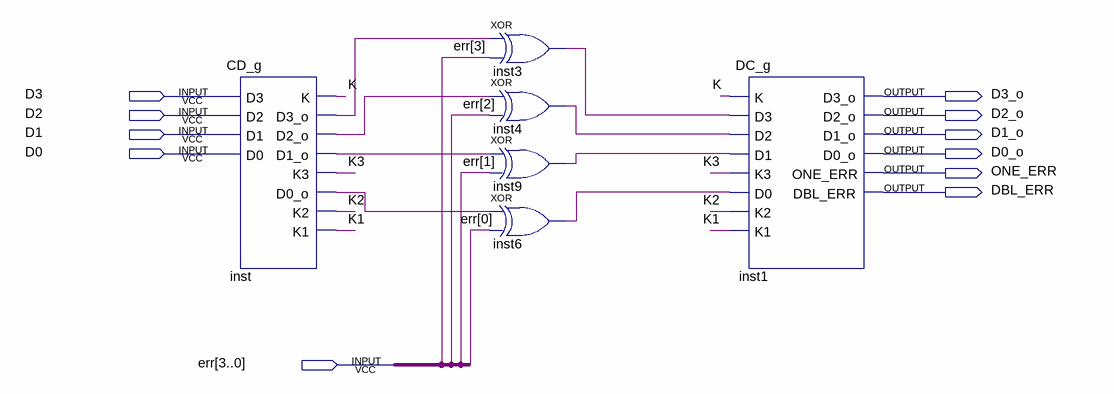
[diagram p0: schematic sheet]
// Quartus schematic data_transf.bdf as structural Verilog: 6 symbols, 11 pins
module data_transf (
  input  D3,
  input  D2,
  input  D1,
  input  D0,
  input  [3:0] err,
  output D3_o,
  output D2_o,
  output D1_o,
  output D0_o,
  output ONE_ERR,
  output DBL_ERR
);

  wire inst3_out, inst4_out, inst6_out, inst9_out, inst_d0_o, inst_d1_o, inst_d2_o, inst_d3_o, K, K1, K2, K3;

  CD_g inst (
    .D3(D3), .D2(D2), .D1(D1), .D0(D0), .K(K), .D3_o(inst_d3_o), .D2_o(inst_d2_o), .D1_o(inst_d1_o), .K3(K3),
    .D0_o(inst_d0_o), .K2(K2), .K1(K1));
  xor inst3 (inst3_out, inst_d3_o, err[3]);
  xor inst4 (inst4_out, inst_d2_o, err[2]);
  xor inst9 (inst9_out, inst_d1_o, err[1]);
  xor inst6 (inst6_out, inst_d0_o, err[0]);
  DC_g inst1 (
    .K(K), .D3(inst3_out), .D2(inst4_out), .D1(inst9_out), .K3(K3), .D0(inst6_out), .K2(K2), .K1(K1),
    .D3_o(D3_o), .D2_o(D2_o), .D1_o(D1_o), .D0_o(D0_o), .ONE_ERR(ONE_ERR), .DBL_ERR(DBL_ERR));
endmodule
